# EAGLE design G603A (EAGLE 6.6.0)
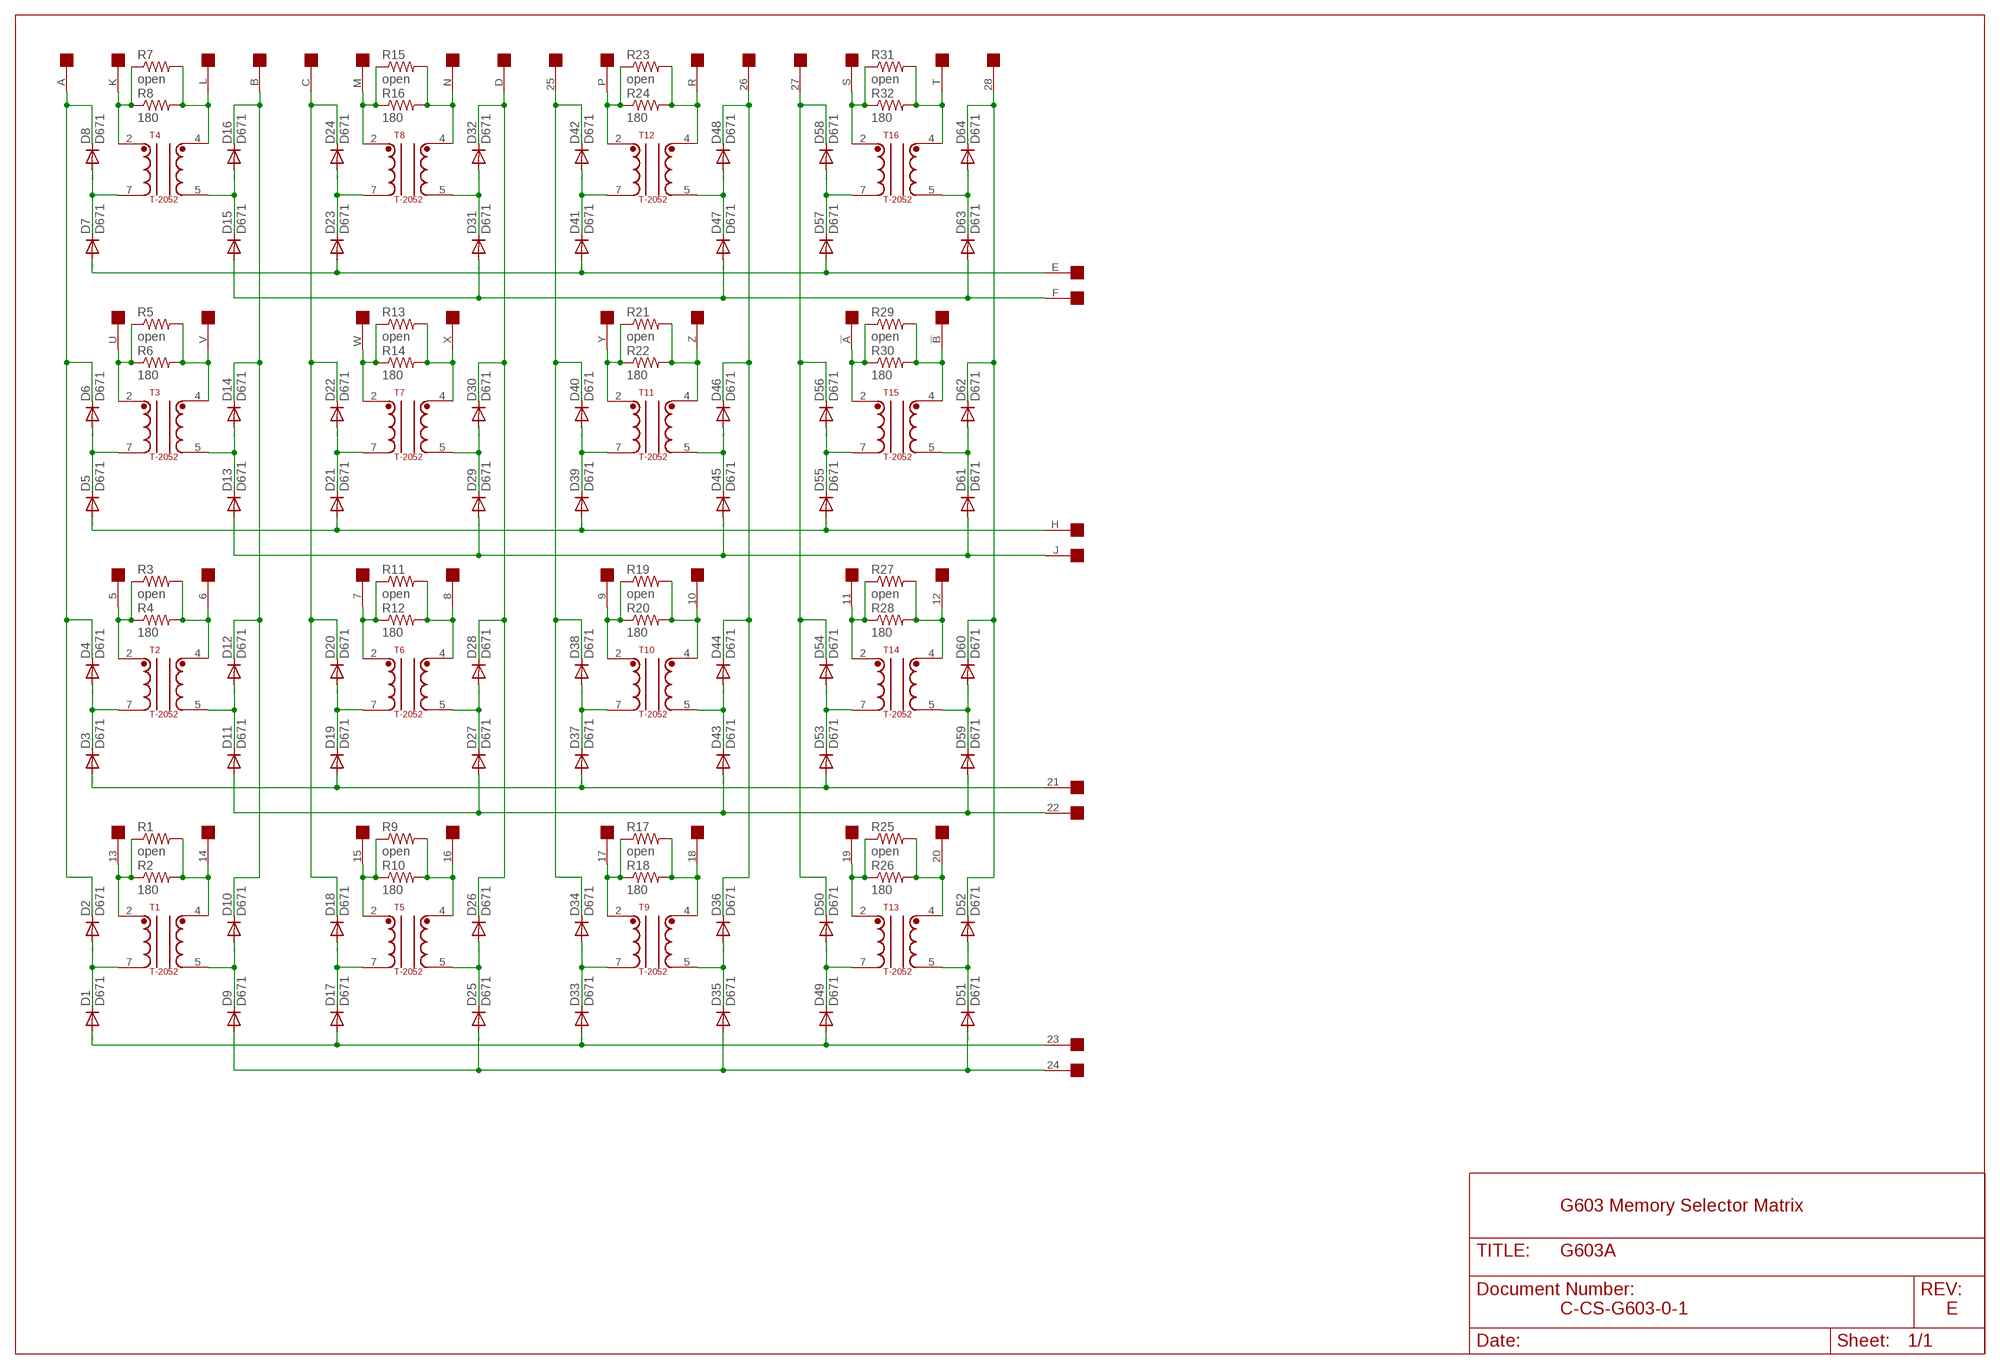
[diagram p0: schematic, sheet 1]

## Parts
D1  D671  DIODE-DO35-10  [DO35-10]
D2  D671  DIODE-DO35-10  [DO35-10]
D3  D671  DIODE-DO35-10  [DO35-10]
D4  D671  DIODE-DO35-10  [DO35-10]
D5  D671  DIODE-DO35-10  [DO35-10]
D6  D671  DIODE-DO35-10  [DO35-10]
D7  D671  DIODE-DO35-10  [DO35-10]
D8  D671  DIODE-DO35-10  [DO35-10]
D9  D671  DIODE-DO35-10  [DO35-10]
D10  D671  DIODE-DO35-10  [DO35-10]
D11  D671  DIODE-DO35-10  [DO35-10]
D12  D671  DIODE-DO35-10  [DO35-10]
D13  D671  DIODE-DO35-10  [DO35-10]
D14  D671  DIODE-DO35-10  [DO35-10]
D15  D671  DIODE-DO35-10  [DO35-10]
D16  D671  DIODE-DO35-10  [DO35-10]
D17  D671  DIODE-DO35-10  [DO35-10]
D18  D671  DIODE-DO35-10  [DO35-10]
D19  D671  DIODE-DO35-10  [DO35-10]
D20  D671  DIODE-DO35-10  [DO35-10]
D21  D671  DIODE-DO35-10  [DO35-10]
D22  D671  DIODE-DO35-10  [DO35-10]
D23  D671  DIODE-DO35-10  [DO35-10]
D24  D671  DIODE-DO35-10  [DO35-10]
D25  D671  DIODE-DO35-10  [DO35-10]
D26  D671  DIODE-DO35-10  [DO35-10]
D27  D671  DIODE-DO35-10  [DO35-10]
D28  D671  DIODE-DO35-10  [DO35-10]
D29  D671  DIODE-DO35-10  [DO35-10]
D30  D671  DIODE-DO35-10  [DO35-10]
D31  D671  DIODE-DO35-10  [DO35-10]
D32  D671  DIODE-DO35-10  [DO35-10]
D33  D671  DIODE-DO35-10  [DO35-10]
D34  D671  DIODE-DO35-10  [DO35-10]
D35  D671  DIODE-DO35-10  [DO35-10]
D36  D671  DIODE-DO35-10  [DO35-10]
D37  D671  DIODE-DO35-10  [DO35-10]
D38  D671  DIODE-DO35-10  [DO35-10]
D39  D671  DIODE-DO35-10  [DO35-10]
D40  D671  DIODE-DO35-10  [DO35-10]
D41  D671  DIODE-DO35-10  [DO35-10]
D42  D671  DIODE-DO35-10  [DO35-10]
D43  D671  DIODE-DO35-10  [DO35-10]
D44  D671  DIODE-DO35-10  [DO35-10]
D45  D671  DIODE-DO35-10  [DO35-10]
D46  D671  DIODE-DO35-10  [DO35-10]
D47  D671  DIODE-DO35-10  [DO35-10]
D48  D671  DIODE-DO35-10  [DO35-10]
D49  D671  DIODE-DO35-10  [DO35-10]
D50  D671  DIODE-DO35-10  [DO35-10]
D51  D671  DIODE-DO35-10  [DO35-10]
D52  D671  DIODE-DO35-10  [DO35-10]
D53  D671  DIODE-DO35-10  [DO35-10]
D54  D671  DIODE-DO35-10  [DO35-10]
D55  D671  DIODE-DO35-10  [DO35-10]
D56  D671  DIODE-DO35-10  [DO35-10]
D57  D671  DIODE-DO35-10  [DO35-10]
D58  D671  DIODE-DO35-10  [DO35-10]
D59  D671  DIODE-DO35-10  [DO35-10]
D60  D671  DIODE-DO35-10  [DO35-10]
D61  D671  DIODE-DO35-10  [DO35-10]
D62  D671  DIODE-DO35-10  [DO35-10]
D63  D671  DIODE-DO35-10  [DO35-10]
D64  D671  DIODE-DO35-10  [DO35-10]
EDGE1  MEM8  [MEM8]
R1  open  R-US_0207/10  [0207/10]
R2  180  R-US_0207/10  [0207/10]
R3  open  R-US_0207/10  [0207/10]
R4  180  R-US_0207/10  [0207/10]
R5  open  R-US_0207/10  [0207/10]
R6  180  R-US_0207/10  [0207/10]
R7  open  R-US_0207/10  [0207/10]
R8  180  R-US_0207/10  [0207/10]
R9  open  R-US_0207/10  [0207/10]
R10  180  R-US_0207/10  [0207/10]
R11  open  R-US_0207/10  [0207/10]
R12  180  R-US_0207/10  [0207/10]
R13  open  R-US_0207/10  [0207/10]
R14  180  R-US_0207/10  [0207/10]
R15  open  R-US_0207/10  [0207/10]
R16  180  R-US_0207/10  [0207/10]
R17  open  R-US_0207/10  [0207/10]
R18  180  R-US_0207/10  [0207/10]
R19  open  R-US_0207/10  [0207/10]
R20  180  R-US_0207/10  [0207/10]
R21  open  R-US_0207/10  [0207/10]
R22  180  R-US_0207/10  [0207/10]
R23  open  R-US_0207/10  [0207/10]
R24  180  R-US_0207/10  [0207/10]
R25  open  R-US_0207/10  [0207/10]
R26  180  R-US_0207/10  [0207/10]
R27  open  R-US_0207/10  [0207/10]
R28  180  R-US_0207/10  [0207/10]
R29  open  R-US_0207/10  [0207/10]
R30  180  R-US_0207/10  [0207/10]
R31  open  R-US_0207/10  [0207/10]
R32  180  R-US_0207/10  [0207/10]
T1  T-2052  [TRANSFORMER]
T2  T-2052  [TRANSFORMER]
T3  T-2052  [TRANSFORMER]
T4  T-2052  [TRANSFORMER]
T5  T-2052  [TRANSFORMER]
T6  T-2052  [TRANSFORMER]
T7  T-2052  [TRANSFORMER]
T8  T-2052  [TRANSFORMER]
T9  T-2052  [TRANSFORMER]
T10  T-2052  [TRANSFORMER]
T11  T-2052  [TRANSFORMER]
T12  T-2052  [TRANSFORMER]
T13  T-2052  [TRANSFORMER]
T14  T-2052  [TRANSFORMER]
T15  T-2052  [TRANSFORMER]
T16  T-2052  [TRANSFORMER]

## Nets
N$1: D1.C D2.A T1.7
N$2: D1.A D17.A D33.A D49.A EDGE1.23
N$3: EDGE1.13 R1.1 R2.1 T1.2
N$4: D10.C D12.C D14.C D16.C EDGE1.B
N$5: D9.C D10.A T1.5
N$6: D9.A D25.A D35.A D51.A EDGE1.24
N$7: D7.C D8.A T4.7
N$8: D7.A D23.A D41.A D57.A EDGE1.E
N$9: D2.C D4.C D6.C D8.C EDGE1.A
N$10: D5.C D6.A T3.7
N$11: D15.C D16.A T4.5
N$12: D15.A D31.A D47.A D63.A EDGE1.F
N$13: D5.A D21.A D39.A D55.A EDGE1.H
N$14: EDGE1.U R5.1 R6.1 T3.2
N$15: EDGE1.V R5.2 R6.2 T3.4
N$16: D13.C D14.A T3.5
N$17: D13.A D29.A D45.A D61.A EDGE1.J
N$18: D3.C D4.A T2.7
N$19: D3.A D19.A D37.A D53.A EDGE1.21
N$20: EDGE1.5 R3.1 R4.1 T2.2
N$21: EDGE1.6 R3.2 R4.2 T2.4
N$22: D11.C D12.A T2.5
N$23: D11.A D27.A D43.A D59.A EDGE1.22
N$24: D17.C D18.A T5.7
N$25: EDGE1.L R7.2 R8.2 T4.4
N$26: EDGE1.15 R9.1 R10.1 T5.2
N$27: D26.C D28.C D30.C D32.C EDGE1.D
N$28: D25.C D26.A T5.5
N$29: D19.C D20.A T6.7
N$30: D18.C D20.C D22.C D24.C EDGE1.C
N$31: EDGE1.7 R11.1 R12.1 T6.2
N$32: EDGE1.8 R11.2 R12.2 T6.4
N$33: D27.C D28.A T6.5
N$34: EDGE1.16 R9.2 R10.2 T5.4
N$35: EDGE1.K R7.1 R8.1 T4.2
N$36: D21.C D22.A T7.7
N$37: EDGE1.W R13.1 R14.1 T7.2
N$38: EDGE1.X R13.2 R14.2 T7.4
N$39: D29.C D30.A T7.5
N$42: D23.C D24.A T8.7
N$43: EDGE1.M R15.1 R16.1 T8.2
N$44: EDGE1.N R15.2 R16.2 T8.4
N$45: D31.C D32.A T8.5
N$47: EDGE1.14 R1.2 R2.2 T1.4
N$52: D33.C D34.A T9.7
N$53: EDGE1.17 R17.1 R18.1 T9.2
N$54: D36.C D44.C D46.C D48.C EDGE1.26
N$55: D35.C D36.A T9.5
N$56: D34.C D38.C D40.C D42.C EDGE1.25
N$57: D37.C D38.A T10.7
N$58: EDGE1.9 R19.1 R20.1 T10.2
N$59: EDGE1.10 R19.2 R20.2 T10.4
N$60: D43.C D44.A T10.5
N$61: D39.C D40.A T11.7
N$62: EDGE1.Y R21.1 R22.1 T11.2
N$63: EDGE1.Z R21.2 R22.2 T11.4
N$64: D45.C D46.A T11.5
N$65: D41.C D42.A T12.7
N$66: EDGE1.P R23.1 R24.1 T12.2
N$67: EDGE1.R R23.2 R24.2 T12.4
N$68: D47.C D48.A T12.5
N$69: EDGE1.18 R17.2 R18.2 T9.4
N$78: D49.C D50.A T13.7
N$79: EDGE1.19 R25.1 R26.1 T13.2
N$80: D52.C D60.C D62.C D64.C EDGE1.28
N$81: D51.C D52.A T13.5
N$82: D50.C D54.C D56.C D58.C EDGE1.27
N$83: D53.C D54.A T14.7
N$84: EDGE1.11 R27.1 R28.1 T14.2
N$85: EDGE1.12 R27.2 R28.2 T14.4
N$86: D59.C D60.A T14.5
N$87: D55.C D56.A T15.7
N$88: EDGE1.!A R29.1 R30.1 T15.2
N$89: EDGE1.!B R29.2 R30.2 T15.4
N$90: D61.C D62.A T15.5
N$91: D57.C D58.A T16.7
N$92: EDGE1.S R31.1 R32.1 T16.2
N$93: EDGE1.T R31.2 R32.2 T16.4
N$94: D63.C D64.A T16.5
N$95: EDGE1.20 R25.2 R26.2 T13.4
Unconnected: EDGE1.1 EDGE1.2 EDGE1.3 EDGE1.4 EDGE1.!C EDGE1.!D EDGE1.!E EDGE1.!F

## Notes on the sheet
- G603 Memory Selector Matrix
- C-CS-G603-0-1 | E

## Library data of the parts
D1-D64 = diode:DIODE-: DIODE
EDGE1 = dec-con:MEM8: .156" Edge connector and outline for straight-8 memory cards
R1-R32 = rcl:R-US_: RESISTOR, American symbol
T1-T16 = dec-con:T-2052: T-2052 Transformer

## Board
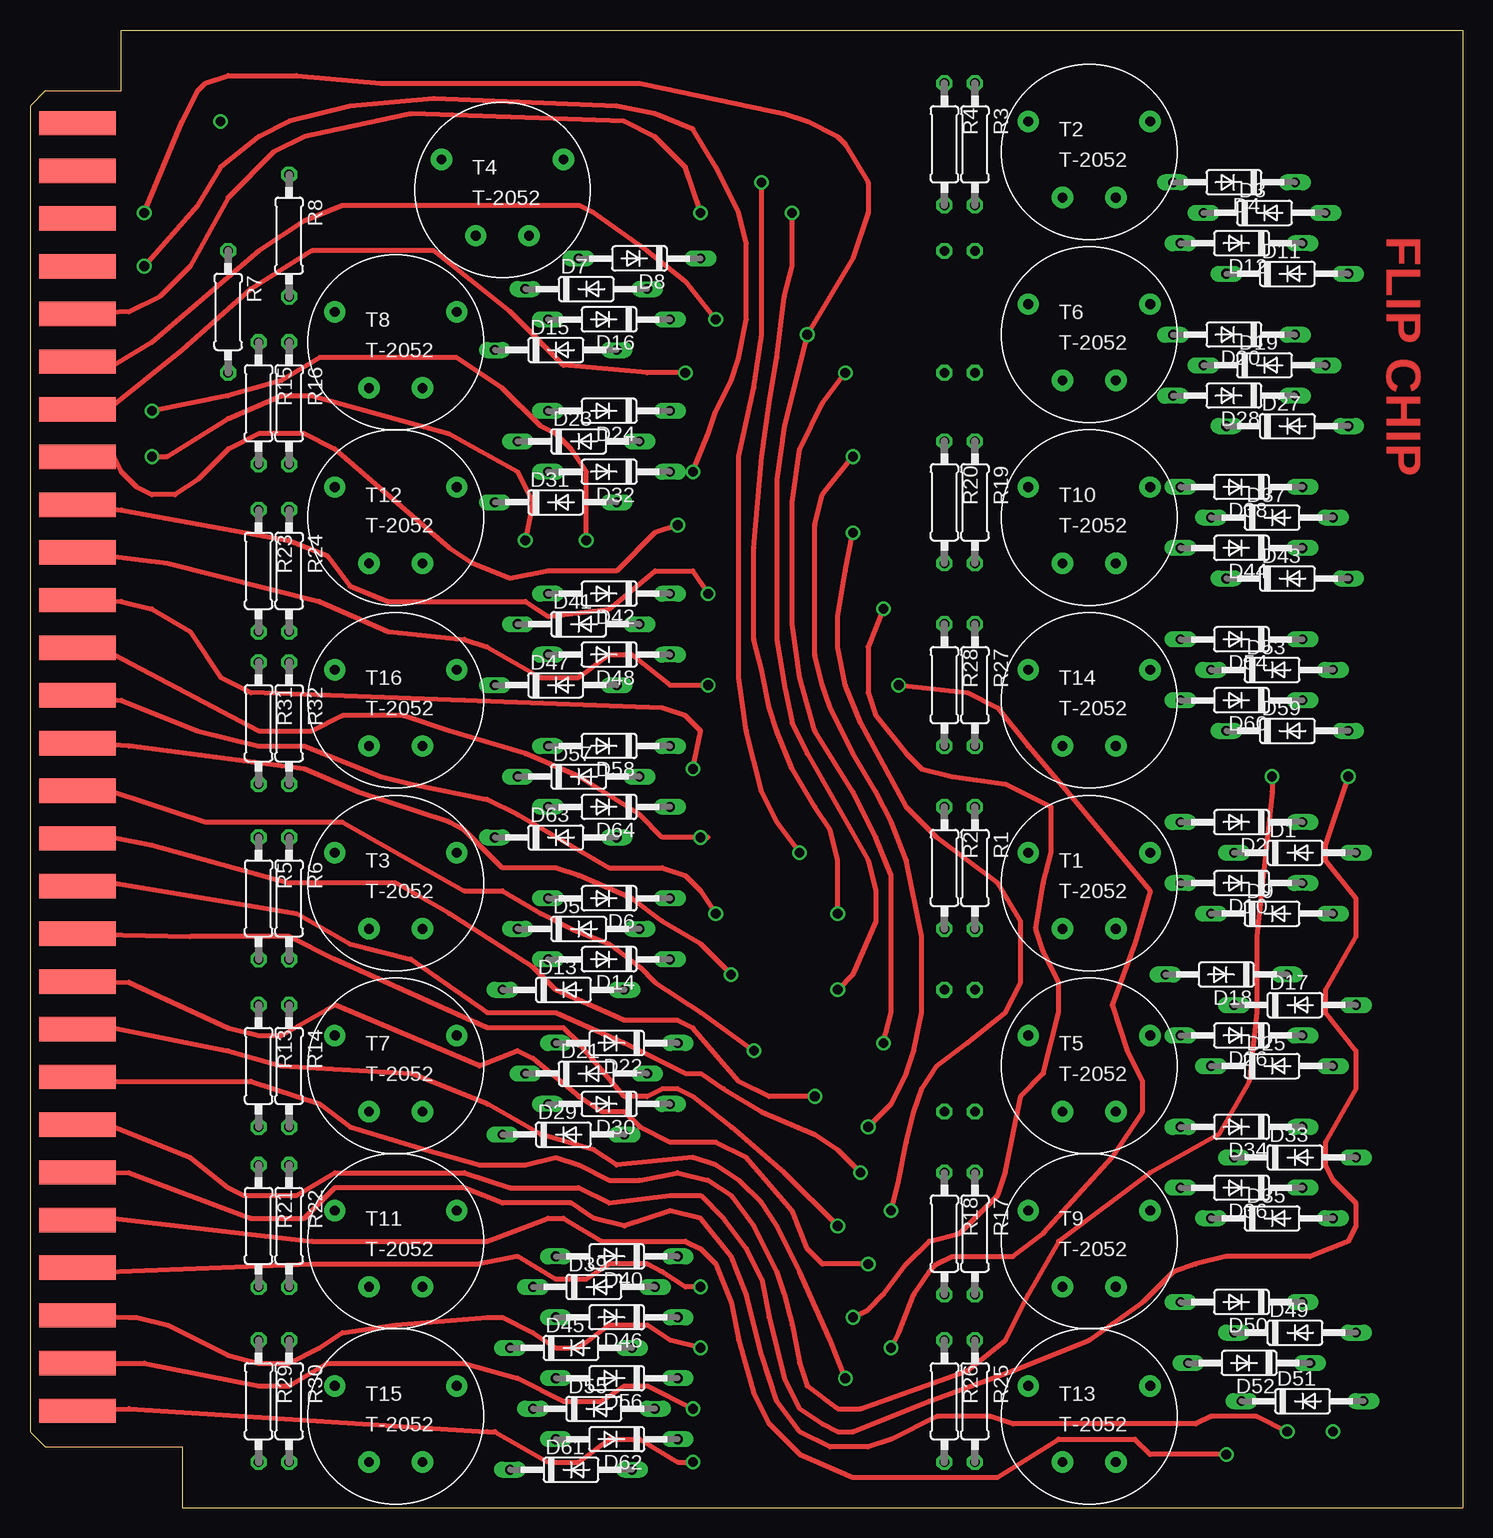
[diagram p1: board, top side]
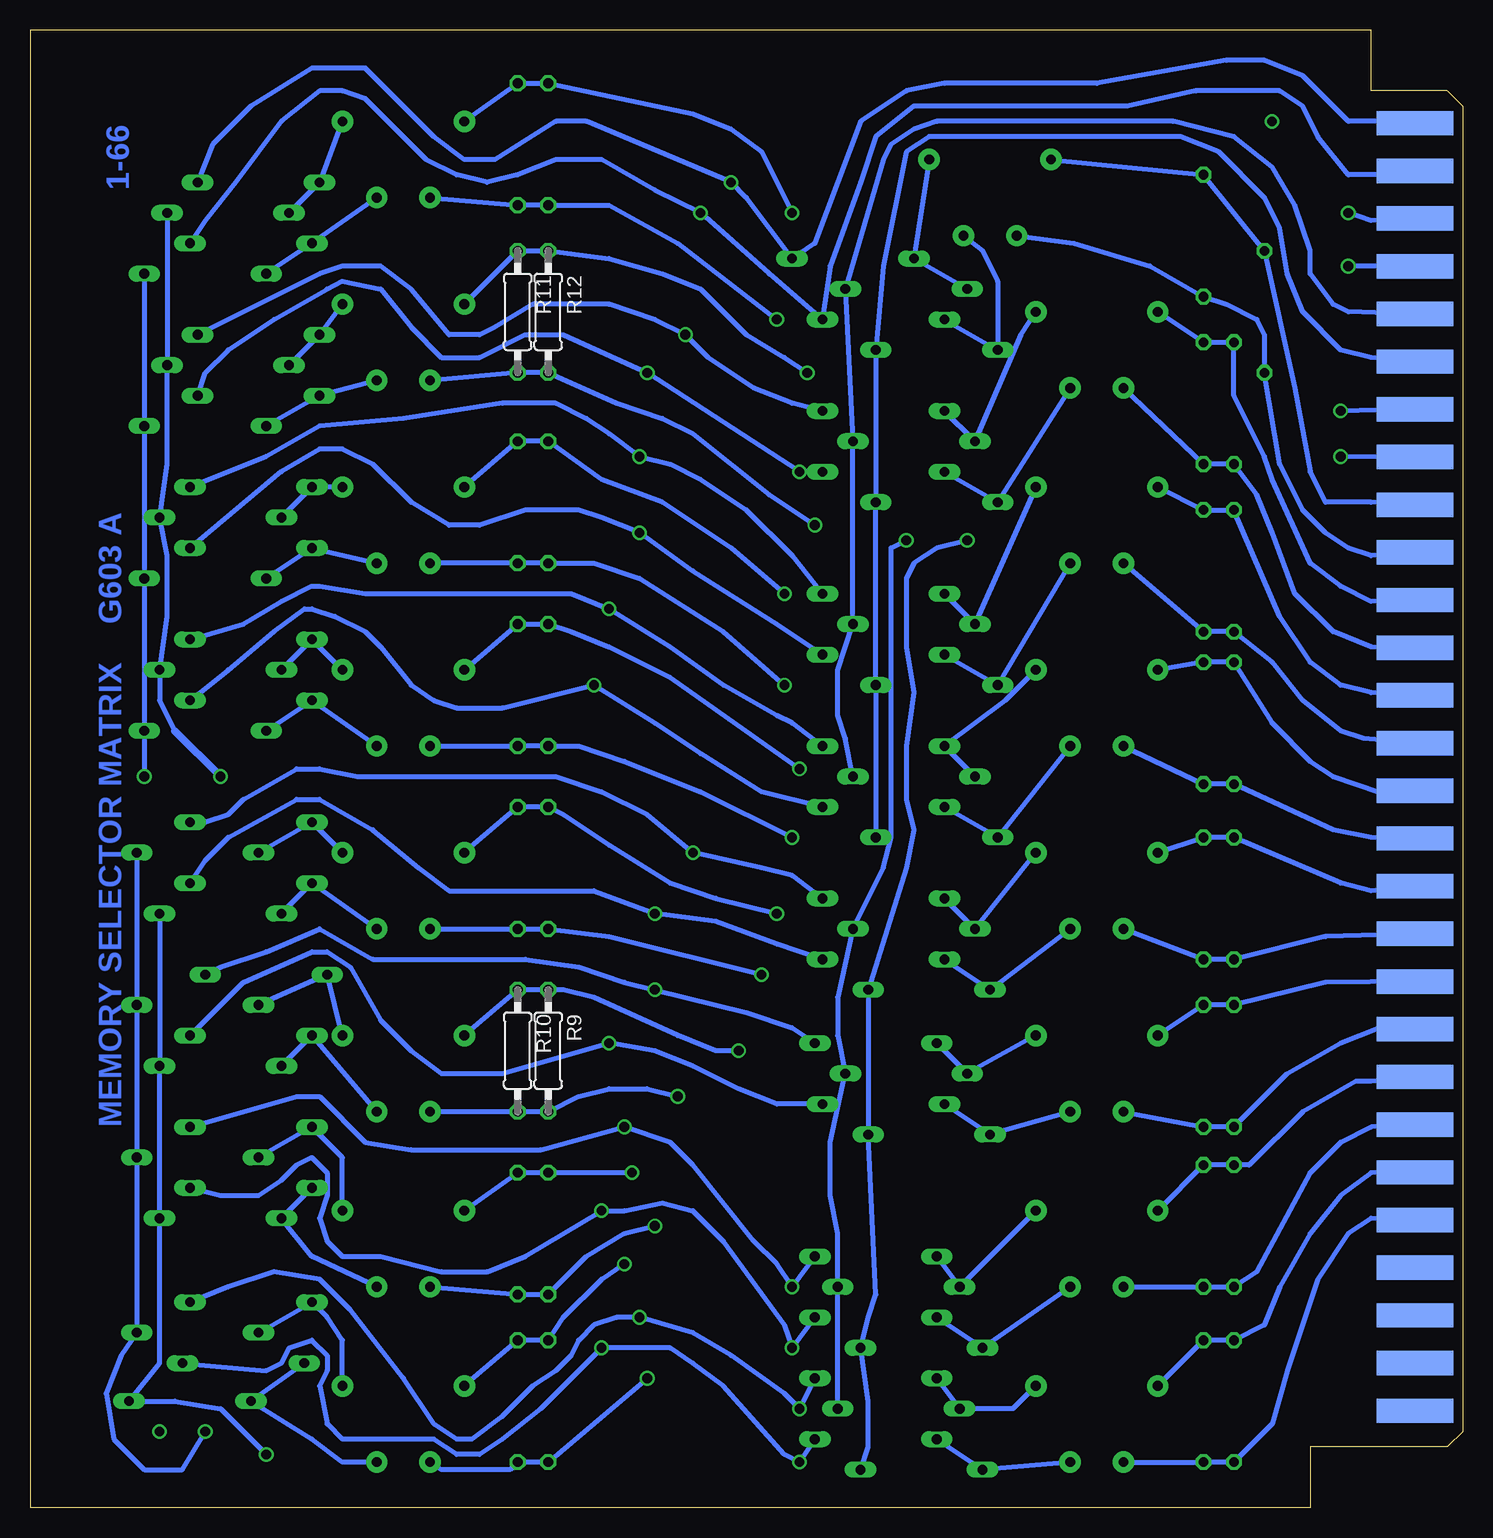
[diagram p2: board, bottom side, seen from below]

Size 119.38 x 123.19 mm. Coordinates in mm from the lower left corner, seen from the top.
Copper layers (1+16): Top 0.035mm / dielectric 1.5mm / Bottom 0.035mm
Design rules "16mils": minimum track width 16mil, minimum drill 32mil, track to track 15mil, track to pad 10mil, pad to pad 10mil, via to via 10mil, smd to smd 10mil, copper to edge 13mil, drill to drill 10mil, minimum pad ring 10mil, minimum via ring 8mil, stop-mask expansion 0mil, vias tented up to drill 0mil, thermal gap 10mil

### Footprints (pad centres in the part's own frame; a part is rotated, then mirrored left to right if it is on the bottom)
DO35-10 = drill 0.813 long: A 5.08,0; C -5.08,0
MEM8 = smd 6.35 x 2.032: 1 3.962,115.418; 2 3.962,111.442; 3 3.962,107.467; 4 3.962,103.492; 5 3.962,99.517; 6 3.962,95.542; 7 3.962,91.567; 8 3.962,87.592; 9 3.962,83.617; 10 3.962,79.642; 11 3.962,75.667; 12 3.962,71.692; 13 3.962,67.716; 14 3.962,63.741; 15 3.962,59.766; 16 3.962,55.791; 17 3.962,51.816; 18 3.962,47.841; 19 3.962,43.866; 20 3.962,39.891; 21 3.962,35.916; 22 3.962,31.941; 23 3.962,27.965; 24 3.962,23.99; 25 3.962,20.015; 26 3.962,16.04; 27 3.962,12.065; 28 3.962,8.09 | smd 6.35 x 2.032 bottom: !A 3.962,27.965; !B 3.962,23.99; !C 3.962,20.015; !D 3.962,16.04; !E 3.962,12.065; !F 3.962,8.09; A 3.962,115.418; B 3.962,111.442; C 3.962,107.467; D 3.962,103.492; E 3.962,99.517; F 3.962,95.542; H 3.962,91.567; J 3.962,87.592; K 3.962,83.617; L 3.962,79.642; M 3.962,75.667; N 3.962,71.692; P 3.962,67.716; R 3.962,63.741; S 3.962,59.766; T 3.962,55.791; U 3.962,51.816; V 3.962,47.841; W 3.962,43.866; X 3.962,39.891; Y 3.962,35.916; Z 3.962,31.941
0207/10 = drill 0.813 octagon: 1 -5.08,0; 2 5.08,0
TRANSFORMER = drill 0.813 pad 1.778: 2 -5.08,2.54; 4 -2.223,-3.81; 5 2.223,-3.81; 7 5.08,2.54

### Placement (x,y rotation side)
D1  105.41,54.61 0 top
D2  100.97,57.15 180 top
D3  102.87,107.95 0 top
D4  100.33,110.49 180 top
D5  45.72,48.26 0 top
D6  48.26,50.8 180 top
D7  46.35,101.6 0 top
D8  50.8,104.14 180 top
D9  103.5,49.53 0 top
D10  100.97,52.07 180 top
D11  104.78,102.87 0 top
D12  100.97,105.41 180 top
D13  44.45,43.18 0 top
D14  48.26,45.72 180 top
D15  43.81,96.52 0 top
D16  48.26,99.06 180 top
D17  105.41,41.91 0 top
D18  99.69,44.45 180 top
D19  102.87,95.25 0 top
D20  100.33,97.79 180 top
D21  46.35,36.2 0 top
D22  48.9,38.73 180 top
D23  45.72,88.9 0 top
D24  48.26,91.44 180 top
D25  103.5,36.83 0 top
D26  100.97,39.37 180 top
D27  104.78,90.17 0 top
D28  100.33,92.71 180 top
D29  44.45,31.11 0 top
D30  48.26,33.66 180 top
D31  43.81,83.82 0 top
D32  48.26,86.36 180 top
D33  105.41,29.21 0 top
D34  100.97,31.75 180 top
D35  103.5,24.13 0 top
D36  100.97,26.67 180 top
D37  103.5,82.55 0 top
D38  100.97,85.09 180 top
D39  46.99,18.41 0 top
D40  48.9,20.95 180 top
D41  45.72,73.66 0 top
D42  48.26,76.2 180 top
D43  104.78,77.47 0 top
D44  100.97,80.01 180 top
D45  45.09,13.34 0 top
D46  48.9,15.88 180 top
D47  43.81,68.58 0 top
D48  48.26,71.12 180 top
D49  105.41,14.61 0 top
D50  100.97,17.14 180 top
D51  106.05,8.89 0 top
D52  101.6,12.06 180 top
D53  103.5,69.85 0 top
D54  100.97,72.39 180 top
D55  46.99,8.26 0 top
D56  48.9,10.79 180 top
D57  45.72,60.96 0 top
D58  48.26,63.5 180 top
D59  104.78,64.77 0 top
D60  100.97,67.31 180 top
D61  45.09,3.17 0 top
D62  48.9,5.71 180 top
D63  43.81,55.88 0 top
D64  48.26,58.42 180 top
EDGE1  0,0 0 top
R1  78.74,53.34 270 top
R2  76.2,53.34 270 top
R3  78.74,113.67 270 top
R4  76.2,113.67 270 top
R5  19.05,50.8 270 top
R6  21.59,50.8 270 top
R7  16.51,99.69 270 top
R8  21.59,106.05 270 top
R9  76.2,38.1 270 bottom
R10  78.74,38.1 270 bottom
R11  78.74,99.69 270 bottom
R12  76.2,99.69 270 bottom
R13  19.05,36.83 270 top
R14  21.59,36.83 270 top
R15  19.05,92.08 270 top
R16  21.59,92.08 270 top
R17  78.74,22.86 270 top
R18  76.2,22.86 270 top
R19  78.74,83.82 270 top
R20  76.2,83.82 270 top
R21  19.05,23.5 270 top
R22  21.59,23.5 270 top
R23  19.05,78.11 270 top
R24  21.59,78.11 270 top
R25  78.74,8.89 270 top
R26  76.2,8.89 270 top
R27  78.74,68.58 270 top
R28  76.2,68.58 270 top
R29  19.05,8.89 270 top
R30  21.59,8.89 270 top
R31  19.05,65.41 270 top
R32  21.59,65.41 270 top
T1  88.27,52.07 0 top
T2  88.27,113.03 0 top
T3  30.48,52.07 0 top
T4  39.37,109.86 0 top
T5  88.27,36.83 0 top
T6  88.27,97.79 0 top
T7  30.48,36.83 0 top
T8  30.48,97.16 0 top
T9  88.27,22.23 0 top
T10  88.27,82.55 0 top
T11  30.48,22.23 0 top
T12  30.48,82.55 0 top
T13  88.27,7.62 0 top
T14  88.27,67.31 0 top
T15  30.48,7.62 0 top
T16  30.48,67.31 0 top

### Tracks (layer width: path | path; a pad name or v marks a point on that pad's centre or on a via)
N$1
  Bottom 0.406: T1.7 D2.A D1.C
N$2  (via drill 0.81)
  Top 0.406: v104.78,6.35 102.23,7.62 98.42,7.62 97.16,6.99 81.92,6.99 80.01,7.62 75.56,7.62 71.75,5.71 69.85,5.08 66.67,5.08 64.14,6.35 62.23,8.89 60.96,12.7 59.69,17.78 58.42,20.95 55.88,24.13 53.34,24.77 49.53,23.5 46.99,24.13 45.09,25.4 39.37,25.4 36.2,26.67 25.4,26.67 22.86,24.13 18.41,24.13 8.26,27.94 EDGE1.23
  Bottom 0.406: D1.A D17.A D33.A D49.A 111.76,12.7 113.03,9.53 112.39,5.71 109.86,3.17 106.68,3.17 v104.78,6.35
N$3  (via drill 0.81)
  Top 0.406: EDGE1.13 7.62,67.31 13.97,64.77 19.05,63.5 22.86,63.5 29.21,60.96 31.75,60.33 38.1,59.05 40.64,57.78 48.26,53.34 52.7,53.34 54.61,52.7 55.88,51.44 v57.15,49.53
  Bottom 0.406: T1.2 R1.1 R2.1 74.93,57.78 71.12,55.24 66.04,52.07 62.23,50.8 v57.15,49.53
N$4  (via drill 0.81)
  Top 0.406: v67.31,49.53 67.31,53.98 66.67,56.52 65.41,58.42 63.5,61.59 62.23,64.77 61.59,66.67 60.96,69.85 60.33,72.39 60.33,80.01 60.96,87.63 61.59,92.08 62.23,95.89 62.87,100.97 63.5,103.5 v63.5,107.95
  Bottom 0.406: EDGE1.B 6.99,111.12 9.53,111.12 12.06,114.3 13.34,116.84 15.24,118.11 22.23,118.11 27.94,116.84 45.72,116.84 48.9,114.3 50.16,110.49 52.7,103.5 D16.C 57.78,102.87 v63.5,107.95 67.31,109.86 71.75,112.39 75.56,112.39 78.74,111.12 81.28,110.49 83.82,111.12 86.36,112.39 91.44,117.47 93.34,118.11 95.25,118.11 98.42,115.57 102.23,110.49 104.78,107.31 D12.C | D14.C 57.15,46.99 62.23,48.9 v67.31,49.53 72.39,51.44 84.45,51.44 87,53.34 90.81,56.52 95.25,59.05 97.16,59.05 102.87,55.88 104.78,53.98 D10.C
N$5
  Bottom 0.406: D9.C D10.A T1.5
N$6  (via drill 0.81)
  Top 0.406: v99.69,4.45 93.34,4.45 92.08,5.71 85.72,5.71 80.64,2.54 68.58,2.54 64.14,4.45 61.59,6.99 60.33,9.53 59.05,13.97 58.42,17.14 57.15,20.32 55.88,21.59 54.61,22.23 47.62,22.23 44.45,24.13 43.18,24.13 38.1,22.23 23.5,22.23 6.99,24.13 EDGE1.24
  Bottom 0.406: D9.A D25.A D35.A 108.58,12.06 D51.A 107.31,8.89 103.5,8.26 v99.69,4.45
N$7
  Bottom 0.406: D7.C D8.A T4.7
N$8
  Bottom 0.406: EDGE1.E 9.53,99.69 10.79,100.33 12.7,102.87 12.7,104.78 13.97,108.58 15.88,111.76 19.05,114.3 24.13,115.57 43.81,115.57 45.72,114.94 47.62,113.67 48.26,112.39 D7.A D23.A D41.A 52.07,69.85 52.07,66.04 51.44,64.14 D57.A
N$9  (via drill 0.81)
  Top 0.406: v64.14,54.61 62.23,57.15 60.96,59.69 59.69,64.77 59.05,69.22 59.05,87.63 60.33,93.34 60.96,97.79 v60.96,110.49
  Bottom 0.406: EDGE1.A 4.12,115.57 9.53,115.57 13.34,119.38 16.51,120.65 19.68,120.65 30.48,118.75 43.18,118.75 46.35,118.11 50.16,115.57 53.98,105.41 D8.C 59.69,109.22 v60.96,110.49 73.03,115.57 75.56,115.57 80.64,112.39 83.19,112.39 85.72,114.3 91.44,120.02 95.89,120.02 100.97,116.84 104.14,113.67 D4.C | D2.C 104.78,57.15 102.87,57.78 101.6,59.05 97.16,61.59 95.25,61.59 92.08,60.96 75.56,60.96 71.75,59.69 67.94,57.78 v64.14,54.61 58.42,53.34 55.88,52.7 D6.C
N$10
  Bottom 0.406: T3.7 D5.C D6.A
N$11
  Bottom 0.406: D16.A D15.C 38.73,102.23 40.01,104.78 T4.5
N$12
  Bottom 0.406: EDGE1.F 7.62,95.89 10.16,96.52 13.34,99.69 14.61,102.87 15.24,106.68 16.51,109.22 20.32,113.03 23.5,114.3 44.45,114.3 46.35,113.03 48.26,103.5 D15.A D31.A D47.A D63.A
N$13  (via drill 0.81)
  Top 0.406: v46.35,80.64 46.35,86.36 45.09,88.27 43.81,89.53 42.55,90.17 39.37,93.34 35.56,95.89 24.13,95.89 20.95,93.98 16.51,92.71 v10.16,91.44
  Bottom 0.406: EDGE1.H v10.16,91.44 | D55.A D39.A 52.07,22.86 52.7,26.04 52.7,30.48 D21.A 52.07,39.37 52.07,42.55 D5.A 48.26,53.34 47.62,55.88 47.62,80.01 v46.35,80.64
N$14
  Bottom 0.406: T3.2 R6.1 R5.1 10.16,52.07 7.62,51.44 EDGE1.U
N$15
  Bottom 0.406: EDGE1.V 11.43,47.62 R5.2 R6.2 T3.4
N$16
  Bottom 0.406: T3.5 D13.C D14.A
N$17  (via drill 0.81)
  Top 0.406: v10.16,87.63 11.43,87.63 16.51,90.81 20.95,92.71 23.5,92.71 34.92,89.53 40.64,86.36 41.91,83.82 v41.27,80.64
  Bottom 0.406: EDGE1.J v10.16,87.63 | v41.27,80.64 43.81,80.01 45.72,78.74 46.35,77.47 46.35,71.75 45.72,67.94 46.35,63.5 46.35,59.05 45.72,56.52 46.35,53.34 D13.A D29.A 48.9,17.78 49.53,15.88 D45.A 49.53,8.89 49.53,5.08 D61.A
N$18
  Bottom 0.406: T2.7 D4.A D3.C
N$19  (via drill 0.81)
  Top 0.406: EDGE1.21 6.99,35.56 18.41,35.56 24.13,33.66 26.67,31.75 33.02,29.84 37.47,28.57 41.27,28.57 43.81,29.21 45.72,28.57 48.26,27.3 50.8,27.3 53.98,27.94 56.52,27.3 58.42,26.04 60.33,23.5 62.23,19.68 62.87,17.78 63.5,15.24 64.14,12.06 64.77,10.16 67.31,8.26 69.22,8.26 78.11,11.43 81.28,13.97 83.19,17.78 85.72,22.23 93.34,27.94 99.06,31.11 101.6,35.56 102.23,41.27 102.23,47.62 103.5,59.69 v103.5,60.96
  Bottom 0.406: D3.A D19.A 107.95,87 D37.A 107.95,79.38 107.95,74.3 D53.A 108.58,67.31 107.31,64.77
  Bottom 0.61: 107.31,64.77 v103.5,60.96
N$20  (via drill 0.81)
  Top 0.406: v55.88,107.95 54.61,111.76 52.07,114.3 49.53,115.57 31.75,116.2 22.86,114.3 20.32,113.03 16.51,109.22 13.34,103.5 10.79,100.97 8.26,99.69 EDGE1.5
  Bottom 0.406: T2.2 R3.1 R4.1 64.14,116.2 60.96,114.94 58.42,113.03 v55.88,107.95
N$21  (via drill 0.81)
  Top 0.406: EDGE1.6 6.99,95.25 10.16,97.16 19.05,104.78 22.86,107.31 26.04,108.58 45.72,108.58 46.99,107.95 51.44,104.78 54.61,102.23 v57.15,99.06
  Bottom 0.406: T2.4 R3.2 R4.2 71.12,108.58 65.41,105.41 v57.15,99.06
N$22
  Bottom 0.406: T2.5 D12.A D11.C
N$23  (via drill 0.81)
  Top 0.406: EDGE1.22 6.99,31.75 13.34,29.21 16.51,26.67 17.78,26.04 22.23,26.04 25.4,27.94 36.2,27.94 40.01,26.67 45.72,26.67 48.26,25.4 53.34,26.04 55.88,26.04 57.78,24.13 59.69,21.59 60.96,19.05 61.59,15.88 62.87,10.79 64.14,8.26 66.04,6.99 67.31,6.35 68.58,6.35 74.93,8.89 81.92,11.43 88.27,13.97 92.71,17.14 95.25,19.68 97.16,20.32 99.69,20.95 106.68,20.95 109.86,22.23 110.49,23.5 110.49,25.4 108.58,27.3 107.95,28.57 107.95,30.48 110.49,34.92 110.49,38.1 107.95,41.27 107.95,43.18 110.49,47.62 110.49,50.8 107.95,53.98 107.95,55.24 v109.86,60.96
  Bottom 0.406: D11.A D27.A D43.A D59.A v109.86,60.96
N$24
  Bottom 0.406: T5.7 D18.A D17.C
N$25
  Bottom 0.406: T4.4 32.38,105.41 26.04,103.5 R8.2 19.68,100.33 17.14,99.06 16.51,97.79 R7.2 15.24,87 13.34,83.19 11.43,81.28 9.53,80.01 7.62,79.38 EDGE1.L
N$26  (via drill 0.81)
  Top 0.406: EDGE1.15 6.99,59.69 14.61,57.15 26.04,57.15 36.2,51.44 39.37,51.44 42.55,49.53 45.09,48.26 48.26,46.99 50.8,45.09 52.07,43.81 55.88,41.27 v60.33,38.1
  Bottom 0.406: T5.2 R10.1 R9.1 74.93,43.18 72.39,42.55 65.41,39.37 62.23,38.1 v60.33,38.1
N$27  (via drill 0.81)
  Top 0.406: v71.12,38.73 71.75,41.27 71.75,52.7 70.48,55.88 68.58,59.69 65.41,64.77 64.14,69.22 63.5,73.66 63.5,83.82 64.14,88.27 66.04,92.08 v67.94,94.61 | v55.24,86.36 56.52,89.53 57.15,91.44 58.42,93.98 59.05,95.89 59.69,99.06 59.69,105.41 59.05,107.95 57.15,111.76 55.24,114.94 52.07,116.2 48.9,116.84 33.66,117.47 26.67,116.84 21.59,115.57 19.05,114.3 15.88,111.76 13.97,108.58 v9.53,103.5
  Bottom 0.406: EDGE1.D v9.53,103.5 | D28.C 104.78,94.61 102.87,96.52 99.06,99.06 94.61,101.6 93.34,102.23 90.17,101.6 87.63,98.42 85.09,95.89 81.92,95.89 78.11,97.79 74.93,97.79 v67.94,94.61 v55.24,86.36 D32.C | D26.C 101.6,43.81 95.89,46.35 94.61,46.35 92.71,45.09 90.17,40.64 87.63,38.1 85.09,36.2 80.01,36.2 v71.12,38.73 67.31,38.1 64.14,36.83 60.33,34.92 57.15,33.66 D30.C
N$28
  Bottom 0.406: T5.5 D26.A D25.C
N$29
  Bottom 0.406: T6.7 D20.A D19.C
N$30  (via drill 0.81)
  Top 0.406: v9.53,107.95 12.7,115.57 13.97,118.11 14.61,118.75 16.51,119.38 22.23,119.38 29.21,118.75 50.8,118.75 62.87,116.2 64.77,115.57 67.31,114.3 67.94,113.67 69.85,110.49 69.85,107.95 68.58,104.14 v64.77,97.79 62.87,90.17 62.23,85.72 62.23,72.39 62.87,68.58 63.5,65.41 64.77,62.87 69.85,53.98 70.48,51.44 70.48,48.9 68.58,44.45 v67.31,43.18
  Bottom 0.406: EDGE1.C 7.62,107.31 v9.53,107.95 | D20.C 95.25,102.87 93.34,103.5 90.17,103.5 87.63,101.6 84.45,97.79 81.92,97.79 80.64,98.42 77.47,100.33 71.12,100.33 67.31,99.06 v64.77,97.79 62.87,95.89 59.05,93.34 55.88,92.08 D24.C | D22.C 55.88,40.01 59.69,41.27 v67.31,43.18 69.85,43.81 73.66,45.09 78.11,45.72 90.81,45.72 95.25,48.26 99.69,46.35 103.5,45.09 D18.C
N$31  (via drill 0.81)
  Top 0.406: v54.61,94.61 51.44,94.61 44.45,95.25 40.01,99.69 33.66,104.78 23.5,104.78 18.41,101.6 12.7,96.52 6.35,91.44 EDGE1.7
  Bottom 0.406: T6.2 R11.1 R12.1 71.12,104.14 66.67,102.87 63.5,101.6 59.69,97.79 56.52,95.89 v54.61,94.61
N$32  (via drill 0.81)
  Top 0.406: v53.98,81.92 52.07,81.28 48.9,78.11 43.18,78.11 40.01,77.47 36.83,78.74 34.92,80.01 25.4,88.27 22.86,89.53 19.05,89.53 16.51,88.27 13.97,85.72 12.06,84.45 10.16,84.45 8.89,85.09 7.62,86.36 6.99,87.63 EDGE1.8
  Bottom 0.406: T6.4 R11.2 R12.2 70.48,92.08 66.67,90.81 64.14,89.53 57.78,84.45 v53.98,81.92
N$33
  Bottom 0.406: T6.5 D28.A D27.C
N$34  (via drill 0.81)
  Top 0.406: EDGE1.16 6.99,55.88 10.16,55.24 21.59,52.07 30.48,52.07 34.92,49.53 41.91,45.09 43.81,43.18 49.53,40.64 53.98,40.64 55.24,40.01 59.05,35.56 61.59,34.29 v65.41,34.29
  Bottom 0.406: T5.4 R10.2 R9.2 73.66,34.29 71.12,34.92 67.94,34.92 v65.41,34.29
N$35
  Bottom 0.406: T4.2 R8.1 R7.1 13.97,93.34 12.7,86.36 11.43,83.82 7.62,83.82 EDGE1.K
N$36
  Bottom 0.406: D22.A D21.C T7.7
N$37
  Bottom 0.406: T7.2 R14.1 R13.1 11.43,43.81 EDGE1.W
N$38
  Bottom 0.406: T7.4 R14.2 R13.2 14.61,36.2 10.16,38.73 6.99,40.01 EDGE1.X
N$39
  Bottom 0.406: D30.A D29.C T7.5
N$40  (via drill 0.81)
  other vias: 15.88,115.57
N$41  (via drill 0.81)
  other vias: 108.58,6.35
N$42
  Bottom 0.406: T8.7 36.83,97.79 D23.C D24.A
N$43
  Bottom 0.406: T8.2 R16.1 R15.1 19.05,92.71 16.51,87.63 15.88,85.72 12.7,78.74 10.16,76.83 7.62,75.56 EDGE1.M
N$44
  Bottom 0.406: T8.4 R16.2 R15.2 17.14,84.45 15.88,81.28 13.97,76.2 10.79,73.03 7.62,71.75 EDGE1.N
N$45
  Bottom 0.406: T8.5 D31.C D32.A
N$47  (via drill 0.81)
  Top 0.406: v58.42,44.45 55.88,46.99 52.7,48.9 50.16,50.8 45.72,52.7 43.81,53.34 39.37,53.34 36.2,56.52 34.92,57.15 27.3,59.69 22.86,61.59 8.26,63.5 EDGE1.14
  Bottom 0.406: T1.4 R1.2 R2.2 71.12,47.62 v58.42,44.45
N$52
  Bottom 0.406: T9.7 93.34,29.21 D34.A D33.C
N$53  (via drill 0.81)
  Top 0.406: EDGE1.17 6.99,52.07 22.23,49.53 26.67,46.99 31.75,45.72 38.1,41.27 43.81,41.27 49.53,38.73 54.61,36.2 55.88,36.2 57.78,34.92 60.96,33.02 65.41,31.11 67.31,29.84 v69.22,27.94
  Bottom 0.406: T9.2 R17.1 R18.1 v69.22,27.94
N$54  (via drill 0.81)
  Top 0.406: EDGE1.26 8.26,15.88 8.89,15.88 11.43,15.24 16.51,12.7 19.05,12.06 21.59,12.06 24.13,13.34 26.04,14.61 30.48,15.24 38.1,15.88 39.37,15.88 41.91,14.61 43.81,13.34 45.72,13.34 48.26,15.24 51.44,15.24 53.34,13.97 v55.88,13.34 | v71.75,24.77 72.39,27.3 73.03,30.48 73.66,33.02 74.3,34.92 75.56,36.83 78.11,38.73 81.28,41.27 82.55,43.81 82.55,48.9 80.64,52.07 75.56,55.88 73.03,58.42 69.22,65.41 67.94,68.58 67.31,71.75 67.31,74.3 67.94,78.11 v68.58,81.28
  Bottom 0.406: D46.C v55.88,13.34 56.52,15.24 61.59,22.23 64.14,24.77 66.67,25.4 69.85,24.77 v71.75,24.77 78.11,20.95 81.28,19.68 85.09,19.68 90.17,20.95 93.34,20.95 94.61,22.23 95.25,24.13 94.61,26.04 94.61,27.94 95.89,29.21 97.16,28.57 98.42,27.3 100.33,26.04 103.5,26.04 D36.C | D48.C 57.15,73.66 64.14,78.11 v68.58,81.28 71.75,82.55 73.66,83.19 78.11,83.19 81.92,81.92 84.45,81.92 87.63,83.82 90.81,87 93.34,88.27 95.25,88.27 98.42,86.36 D44.C
N$55
  Bottom 0.406: T9.5 95.89,20.95 D35.C D36.A
N$56  (via drill 0.81)
  Top 0.406: EDGE1.25 6.35,19.68 23.5,20.32 37.47,20.32 40.64,20.95 43.81,19.05 46.35,19.05 48.26,20.32 51.44,20.32 52.7,19.68 54.61,18.41 v55.88,18.41 | v69.85,31.75 71.75,33.66 73.03,36.2 73.66,38.1 74.3,41.27 74.3,47.62 73.03,53.98 71.75,57.15 70.48,59.69 68.58,62.87 66.67,66.67 66.04,68.58 65.41,71.12 65.41,81.92 66.04,84.45 v68.58,87.63
  Bottom 0.406: D34.C 97.16,34.29 95.25,34.29 91.44,30.48 87.63,29.84 76.83,29.84 v69.85,31.75 66.04,30.48 64.14,28.57 59.05,22.23 57.15,20.32 v55.88,18.41 D40.C | D42.C 55.88,79.38 59.69,83.19 63.5,85.72 66.04,87 v68.58,87.63 71.12,89.53 73.03,90.81 75.56,92.08 80.01,92.08 88.27,90.81 95.25,90.17 99.69,87.63 D38.C
N$57
  Bottom 0.406: T10.7 D38.A D37.C
N$58  (via drill 0.81)
  Top 0.406: EDGE1.9 7.62,83.19 21.59,80.64 24.77,79.38 26.67,76.83 29.84,75.56 41.27,75.56 43.18,74.3 48.26,74.93 52.07,78.11 55.24,78.11 v56.52,76.2
  Bottom 0.406: v56.52,76.2 60.96,80.01 66.67,83.82 71.75,85.72 R20.1 R19.1 T10.2
N$59  (via drill 0.81)
  Top 0.406: EDGE1.10 6.35,79.38 11.43,78.74 24.13,75.56 29.84,73.03 36.2,72.39 38.1,71.75 42.55,69.22 45.72,69.22 48.26,71.12 50.16,71.12 53.34,68.58 v56.52,68.58
  Bottom 0.406: T10.4 R19.2 R20.2 72.39,78.74 68.58,77.47 61.59,73.03 v56.52,68.58
N$60
  Bottom 0.406: D43.C D44.A T10.5
N$61
  Bottom 0.406: T11.7 D39.C D40.A
N$62
  Bottom 0.406: T11.2 R22.1 R21.1 17.78,28.57 13.34,33.02 8.89,35.56 7.62,35.56 EDGE1.Y
N$63
  Bottom 0.406: EDGE1.Z 7.62,31.75 10.16,30.48 12.7,27.94 17.14,19.68 R21.2 R22.2 T11.4
N$64
  Bottom 0.406: D46.A D45.C T11.5
N$65
  Bottom 0.406: T12.7 D41.C D42.A
N$66
  Bottom 0.406: EDGE1.P 7.62,67.94 10.16,68.58 12.7,70.48 15.24,74.3 R23.1 R24.1 T12.2
N$67
  Bottom 0.406: T12.4 R24.2 R23.2 15.88,70.48 13.34,67.31 10.16,64.77 8.26,64.14 EDGE1.R
N$68
  Bottom 0.406: T12.5 D47.C D48.A
N$69  (via drill 0.81)
  Top 0.406: v67.31,23.5 62.87,27.94 58.42,31.75 55.24,34.29 53.98,34.92 52.7,34.92 51.44,34.29 49.53,34.29 45.72,38.73 44.45,40.01 38.1,40.01 25.4,45.72 21.59,47.62 13.34,47.62 EDGE1.18
  Bottom 0.406: T9.4 R17.2 R18.2 73.03,20.95 69.85,22.86 v67.31,23.5
N$78
  Bottom 0.406: D49.C D50.A 94.61,15.88 93.34,13.97 T13.7
N$79  (via drill 0.81)
  Top 0.406: EDGE1.19 8.26,43.81 16.51,40.01 19.05,39.37 20.95,39.37 25.4,41.91 37.47,36.83 40.64,38.1 41.91,37.47 45.72,34.29 47.62,33.02 49.53,33.02 50.8,31.75 53.34,30.48 57.15,30.48 59.69,29.21 63.5,24.77 64.77,21.59 66.04,20.32 v69.85,20.32
  Bottom 0.406: v69.85,20.32 71.75,19.05 74.93,15.88 R26.1 R25.1 T13.2
N$80  (via drill 0.81)
  Top 0.406: EDGE1.28 8.26,8.26 38.1,6.35 38.73,6.35 43.18,3.81 45.72,3.81 48.26,5.71 50.8,5.71 53.98,3.81 v55.24,3.81 | v71.75,13.34 72.39,14.61 73.66,17.78 74.93,19.68 75.56,20.32 76.83,20.95 81.92,20.95 84.45,22.86 90.17,29.21 92.71,33.02 92.71,35.56 91.44,38.1 90.17,41.91 92.08,46.99 93.34,51.44 87,59.05 83.19,63.5 80.64,66.67 78.11,67.94 v72.39,68.58
  Bottom 0.406: D62.C v55.24,3.81 56.52,4.45 61.59,10.16 64.14,12.06 66.04,13.34 v71.75,13.34 76.83,8.26 80.01,5.71 81.92,4.45 83.82,4.45 85.72,5.71 93.34,5.71 94.61,6.99 95.25,10.16 94.61,11.43 94.61,12.7 95.89,13.97 97.79,13.34 98.42,12.06 99.69,11.43 D52.C | D60.C 102.87,69.85 99.06,73.03 96.52,74.93 95.89,74.93 93.98,74.3 91.44,73.03 90.17,71.75 87.63,68.58 85.72,67.31 83.82,66.67 80.01,66.67 v72.39,68.58 67.31,65.41 63.5,62.87 58.42,59.69 D64.C
N$81
  Bottom 0.406: D52.A D51.C 95.89,5.71 93.34,3.81 T13.5
N$82  (via drill 0.81)
  Top 0.406: EDGE1.27 9.53,12.06 19.05,10.16 21.59,10.16 24.77,12.06 36.2,12.06 40.64,10.79 44.45,8.89 47.62,8.89 49.53,10.16 51.44,10.16 v55.24,8.26 | v68.58,15.88 69.85,16.51 71.12,17.78 73.03,20.32 74.93,22.23 77.47,22.86 80.64,26.04 81.28,27.94 82.55,34.29 84.45,36.2 85.72,41.27 85.72,43.81 84.45,46.35 83.82,48.26 84.45,52.07 85.09,54.61 85.09,58.42 81.28,60.33 76.83,60.96 74.3,61.59 73.03,62.87 70.48,66.04 69.85,67.94 69.85,71.75 v71.12,74.93
  Bottom 0.406: D56.C v55.24,8.26 56.52,9.53 60.96,12.7 64.14,14.61 v68.58,15.88 70.48,15.88 72.39,15.24 73.66,13.97 74.3,12.7 75.56,11.43 77.47,10.16 80.01,7.62 82.55,5.71 83.82,5.71 85.72,6.99 88.27,10.79 92.71,16.51 95.25,19.05 99.06,19.68 102.87,18.41 D50.C | D54.C 101.6,73.66 98.42,75.56 95.89,76.83 95.25,76.83 91.44,76.2 74.3,76.2 v71.12,74.93 66.04,71.75 61.59,68.58 57.15,66.04 55.88,65.41 D58.C
N$83
  Bottom 0.406: T14.7 D54.A D53.C
N$84  (via drill 0.81)
  Top 0.406: EDGE1.11 7.62,75.56 10.16,74.93 13.34,73.03 15.88,69.22 18.41,67.94 36.2,67.31 52.7,66.67 54.61,66.04 55.88,64.77 v55.24,61.59
  Bottom 0.406: T14.2 R27.1 R28.1 74.3,73.03 71.12,71.75 66.04,69.22 v55.24,61.59
N$85  (via drill 0.81)
  Top 0.406: EDGE1.12 6.99,71.12 19.05,64.77 23.5,64.77 26.04,66.04 31.11,66.04 34.92,64.77 41.27,62.87 45.72,60.96 50.8,57.78 52.7,55.88 v55.88,55.88 56.52,55.88
  Bottom 0.406: T14.4 R27.2 R28.2 73.66,63.5 69.85,62.23 63.5,59.69 v55.88,55.88
N$86
  Bottom 0.406: T14.5 D60.A D59.C
N$87
  Bottom 0.406: T15.7 37.47,8.26 D55.C D56.A
N$88
  Bottom 0.406: EDGE1.!A 7.62,27.94 10.16,26.04 12.7,22.86 15.24,18.41 16.51,15.24 R29.1 R30.1 T15.2
N$89
  Bottom 0.406: T15.4 R30.2 R29.2 15.88,6.99 14.61,11.43 12.06,19.05 9.53,22.86 7.62,24.13 EDGE1.!B
N$90
  Bottom 0.406: T15.5 D61.C D62.A
N$91
  Bottom 0.406: T16.7 38.1,67.31 D58.A D57.C
N$92
  Bottom 0.406: T16.2 R32.1 R31.1 15.88,65.41 12.7,62.23 10.79,60.96 6.99,59.69 EDGE1.S
N$93
  Bottom 0.406: T16.4 R32.2 R31.2 10.79,56.52 7.62,55.88 EDGE1.T
N$94
  Bottom 0.406: T16.5 D63.C D64.A
N$95  (via drill 0.81)
  Top 0.406: v67.94,10.79 66.67,13.97 64.14,19.68 62.23,23.5 60.96,25.4 59.05,27.3 57.15,28.57 55.24,29.21 48.9,28.57 46.99,29.84 42.55,31.11 38.1,33.66 31.75,36.2 20.95,36.83 16.51,38.1 6.99,40.01 EDGE1.20
  Bottom 0.406: T13.4 85.09,3.17 79.38,3.17 R25.2 R26.2 v67.94,10.79

### Text on the board
Top: FLIP CHIP
Bottom: 1-66 | G603 A | MEMORY SELECTOR MATRIX